# Altium schematic sheet TopLevel.SchDoc
size A4; SheetNumber: 2; SheetTotal: 9
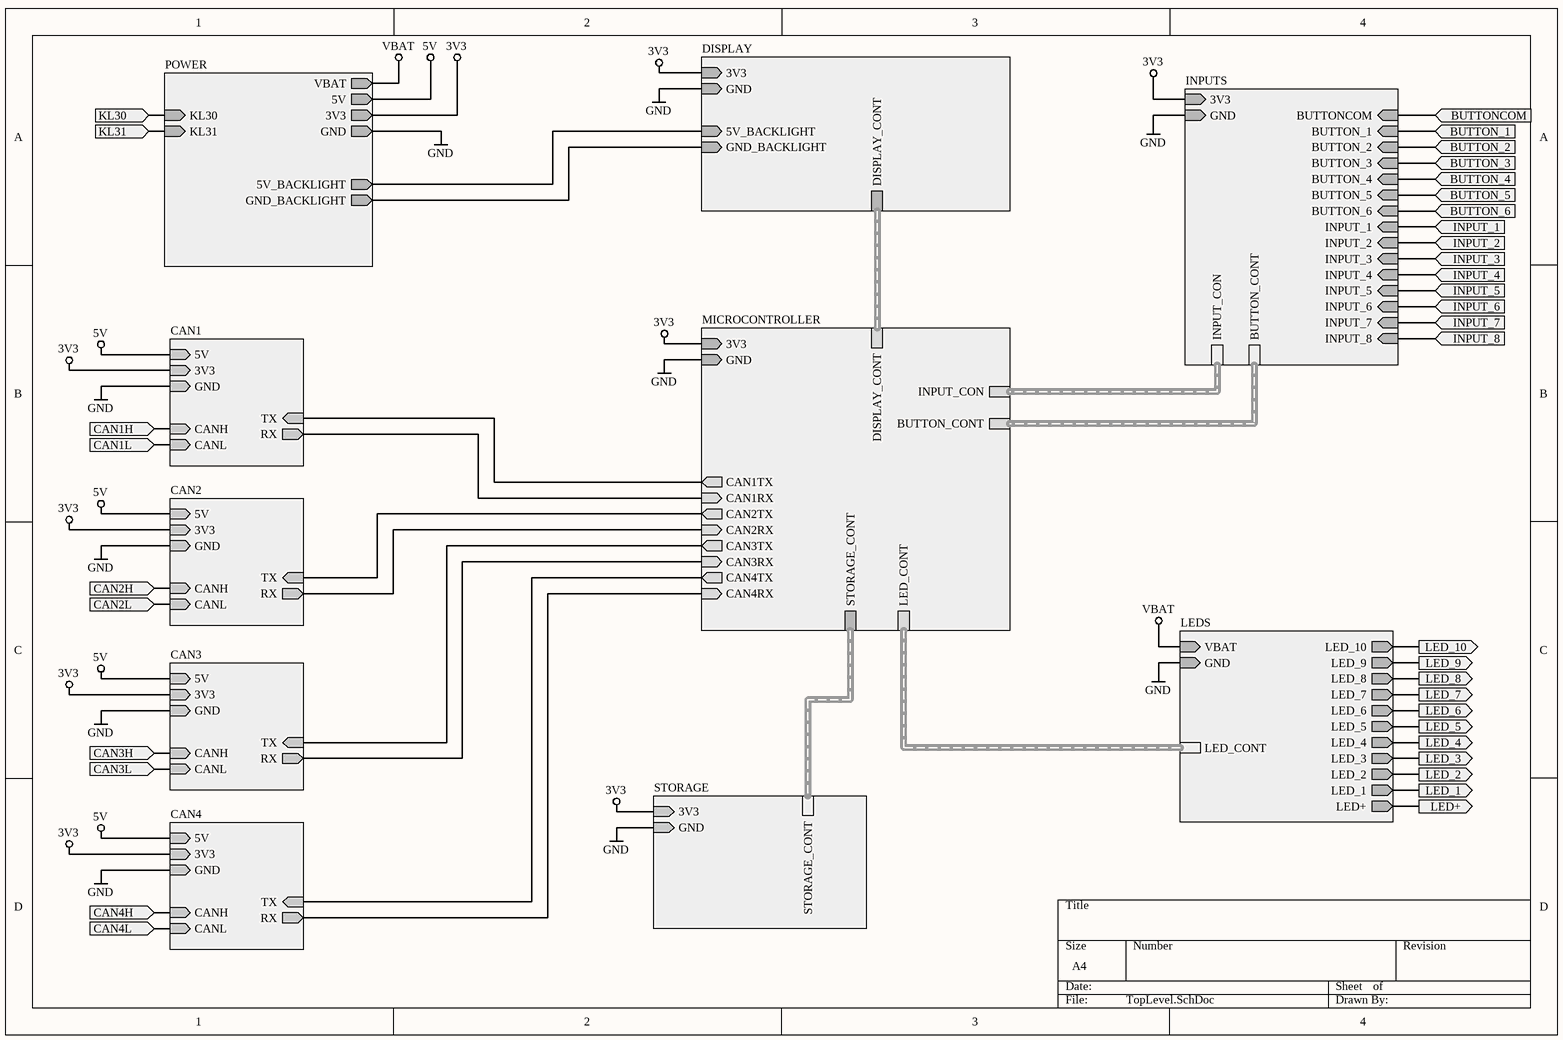
[diagram p0: TopLevel.SchDoc]

## Sub-sheets
CAN1 = CANInterface.SchDoc: 5V (in), GND (in), CANL (in), CANH (in), 3V3 (in), TX (in), RX (out)  | SchematicSymbolName: CAN1
CAN2 = CANInterface.SchDoc: 5V (in), GND (in), CANL (in), CANH (in), 3V3 (in), TX (in), RX (out)  | SchematicSymbolName: CAN2
CAN3 = CANInterface.SchDoc: 5V (in), GND (in), CANL (in), CANH (in), 3V3 (in), TX (in), RX (out)  | SchematicSymbolName: CAN3
CAN4 = CANInterface.SchDoc: 5V (in), GND (in), CANL (in), CANH (in), 3V3 (in), TX (in), RX (out)  | SchematicSymbolName: CAN4
DISPLAY = Display.SchDoc: 5V_BACKLIGHT (in), GND_BACKLIGHT (in), DISPLAY_CONT (harness DISPLAY_CONT), 3V3 (in), GND (in)
INPUTS = Inputs.SchDoc: 3V3 (in), GND (in), BUTTONCOM (in), BUTTON_1 (in), BUTTON_2 (in), BUTTON_3 (in), BUTTON_4 (in), BUTTON_5 (in), BUTTON_6 (in), INPUT_1 (in), INPUT_2 (in), INPUT_3 (in), INPUT_4 (in), INPUT_5 (in), INPUT_6 (in), INPUT_7 (in), INPUT_8 (in), INPUT_CON (harness INPUT_CON), BUTTON_CONT (harness BUTTON_CONT)
LEDS = LEDs.SchDoc: LED_10 (out), LED_9 (out), LED_8 (out), LED_7 (out), LED_6 (out), LED_5 (out), LED_4 (out), LED_3 (out), LED_2 (out), LED_1 (out), LED_CONT (harness LED_CONT), GND (in), VBAT (in), LED+ (out)
MICROCONTROLLER = Microcontroller.SchDoc: STORAGE_CONT (harness STORAGE_CONT), GND (in), 3V3 (in), INPUT_CON (harness INPUT_CON), BUTTON_CONT (harness BUTTON_CONT), LED_CONT (harness LED_CONT), CAN2RX (in), CAN3TX (out), CAN2TX (out), CAN3RX (in), CAN4TX (out), CAN4RX (in), CAN1TX (out), CAN1RX (in), DISPLAY_CONT (harness DISPLAY_CONT)
POWER = Power.SchDoc: KL30 (in), KL31 (in), 5V (out), 5V_BACKLIGHT (out), 3V3 (out), GND (out), GND_BACKLIGHT (out), VBAT (out)
STORAGE = Storage.SchDoc: 3V3 (in), GND (in), STORAGE_CONT (harness STORAGE_CONT)

## Ports
BUTTON_1 (in), BUTTON_2 (in), BUTTON_3 (in), BUTTON_4 (in), BUTTON_5 (in), BUTTON_6 (in), BUTTONCOM (in), CAN1H (in), CAN1L (in), CAN2H (in), CAN2L (in), CAN3H (in), CAN3L (in), CAN4H (in), CAN4L (in), INPUT_1 (in), INPUT_2 (in), INPUT_3 (in), INPUT_4 (in), INPUT_5 (in), INPUT_6 (in), INPUT_7 (in), INPUT_8 (in), KL30 (in), KL31 (in), LED+ (out), LED_1 (out), LED_2 (out), LED_3 (out), LED_4 (out), LED_5 (out), LED_6 (out), LED_7 (out), LED_8 (out), LED_9 (out), LED_10 (out)

## Nets
3V3: sheet DISPLAY/3V3, sheet MICROCONTROLLER/3V3, sheet INPUTS/3V3, sheet POWER/3V3, sheet CAN1/3V3, sheet CAN2/3V3, sheet CAN3/3V3, sheet CAN4/3V3, sheet STORAGE/3V3
5V: sheet POWER/5V, sheet CAN1/5V, sheet CAN2/5V, sheet CAN3/5V, sheet CAN4/5V
GND: sheet DISPLAY/GND, sheet MICROCONTROLLER/GND, sheet INPUTS/GND, sheet LEDS/GND, sheet POWER/GND, sheet CAN1/GND, sheet CAN2/GND, sheet CAN3/GND, sheet CAN4/GND, sheet STORAGE/GND
VBAT: sheet LEDS/VBAT, sheet POWER/VBAT
BUTTON_1: port BUTTON_1, sheet INPUTS/BUTTON_1
BUTTON_2: port BUTTON_2, sheet INPUTS/BUTTON_2
BUTTON_3: port BUTTON_3, sheet INPUTS/BUTTON_3
BUTTON_4: port BUTTON_4, sheet INPUTS/BUTTON_4
BUTTON_5: port BUTTON_5, sheet INPUTS/BUTTON_5
BUTTON_6: port BUTTON_6, sheet INPUTS/BUTTON_6
BUTTONCOM: port BUTTONCOM, sheet INPUTS/BUTTONCOM
CAN1H: port CAN1H, sheet CAN1/CANH
CAN1L: port CAN1L, sheet CAN1/CANL
CAN2H: port CAN2H, sheet CAN2/CANH
CAN2L: port CAN2L, sheet CAN2/CANL
CAN3H: port CAN3H, sheet CAN3/CANH
CAN3L: port CAN3L, sheet CAN3/CANL
CAN4H: port CAN4H, sheet CAN4/CANH
CAN4L: port CAN4L, sheet CAN4/CANL
INPUT_1: port INPUT_1, sheet INPUTS/INPUT_1
INPUT_2: port INPUT_2, sheet INPUTS/INPUT_2
INPUT_3: port INPUT_3, sheet INPUTS/INPUT_3
INPUT_4: port INPUT_4, sheet INPUTS/INPUT_4
INPUT_5: port INPUT_5, sheet INPUTS/INPUT_5
INPUT_6: port INPUT_6, sheet INPUTS/INPUT_6
INPUT_7: port INPUT_7, sheet INPUTS/INPUT_7
INPUT_8: port INPUT_8, sheet INPUTS/INPUT_8
KL30: port KL30, sheet POWER/KL30
KL31: port KL31, sheet POWER/KL31
LED+: port LED+, sheet LEDS/LED+
LED_1: port LED_1, sheet LEDS/LED_1
LED_2: port LED_2, sheet LEDS/LED_2
LED_3: port LED_3, sheet LEDS/LED_3
LED_4: port LED_4, sheet LEDS/LED_4
LED_5: port LED_5, sheet LEDS/LED_5
LED_6: port LED_6, sheet LEDS/LED_6
LED_7: port LED_7, sheet LEDS/LED_7
LED_8: port LED_8, sheet LEDS/LED_8
LED_9: port LED_9, sheet LEDS/LED_9
LED_10: port LED_10, sheet LEDS/LED_10
(unnamed): sheet DISPLAY/5V_BACKLIGHT, sheet POWER/5V_BACKLIGHT
(unnamed): sheet DISPLAY/GND_BACKLIGHT, sheet POWER/GND_BACKLIGHT
(unnamed): sheet MICROCONTROLLER/CAN2RX, sheet CAN2/RX
(unnamed): sheet MICROCONTROLLER/CAN3TX, sheet CAN3/TX
(unnamed): sheet MICROCONTROLLER/CAN2TX, sheet CAN2/TX
(unnamed): sheet MICROCONTROLLER/CAN3RX, sheet CAN3/RX
(unnamed): sheet MICROCONTROLLER/CAN4TX, sheet CAN4/TX
(unnamed): sheet MICROCONTROLLER/CAN4RX, sheet CAN4/RX
(unnamed): sheet MICROCONTROLLER/CAN1TX, sheet CAN1/TX
(unnamed): sheet MICROCONTROLLER/CAN1RX, sheet CAN1/RX

## Buses and harness runs
harness sheet DISPLAY/DISPLAY_CONT = sheet MICROCONTROLLER/DISPLAY_CONT
harness sheet INPUTS/BUTTON_CONT = sheet MICROCONTROLLER/BUTTON_CONT
harness sheet INPUTS/INPUT_CON = sheet MICROCONTROLLER/INPUT_CON
harness sheet LEDS/LED_CONT = sheet MICROCONTROLLER/LED_CONT
harness sheet MICROCONTROLLER/STORAGE_CONT = sheet STORAGE/STORAGE_CONT